# EasyEDA Pro project Choloepus.eprj, schematic Schematic1

## Sheets
1 P1: Create Date: 2024-03-04; Page Name: P1; Project Name: 柔性爪二代; Schematic Name: Schematic1; Update Date: 2024-11-28; Company: Tianjin University; Drawed: Xiang Chang; Page Size: A4; Reviewed: Xiang Chang; Version: V2.0
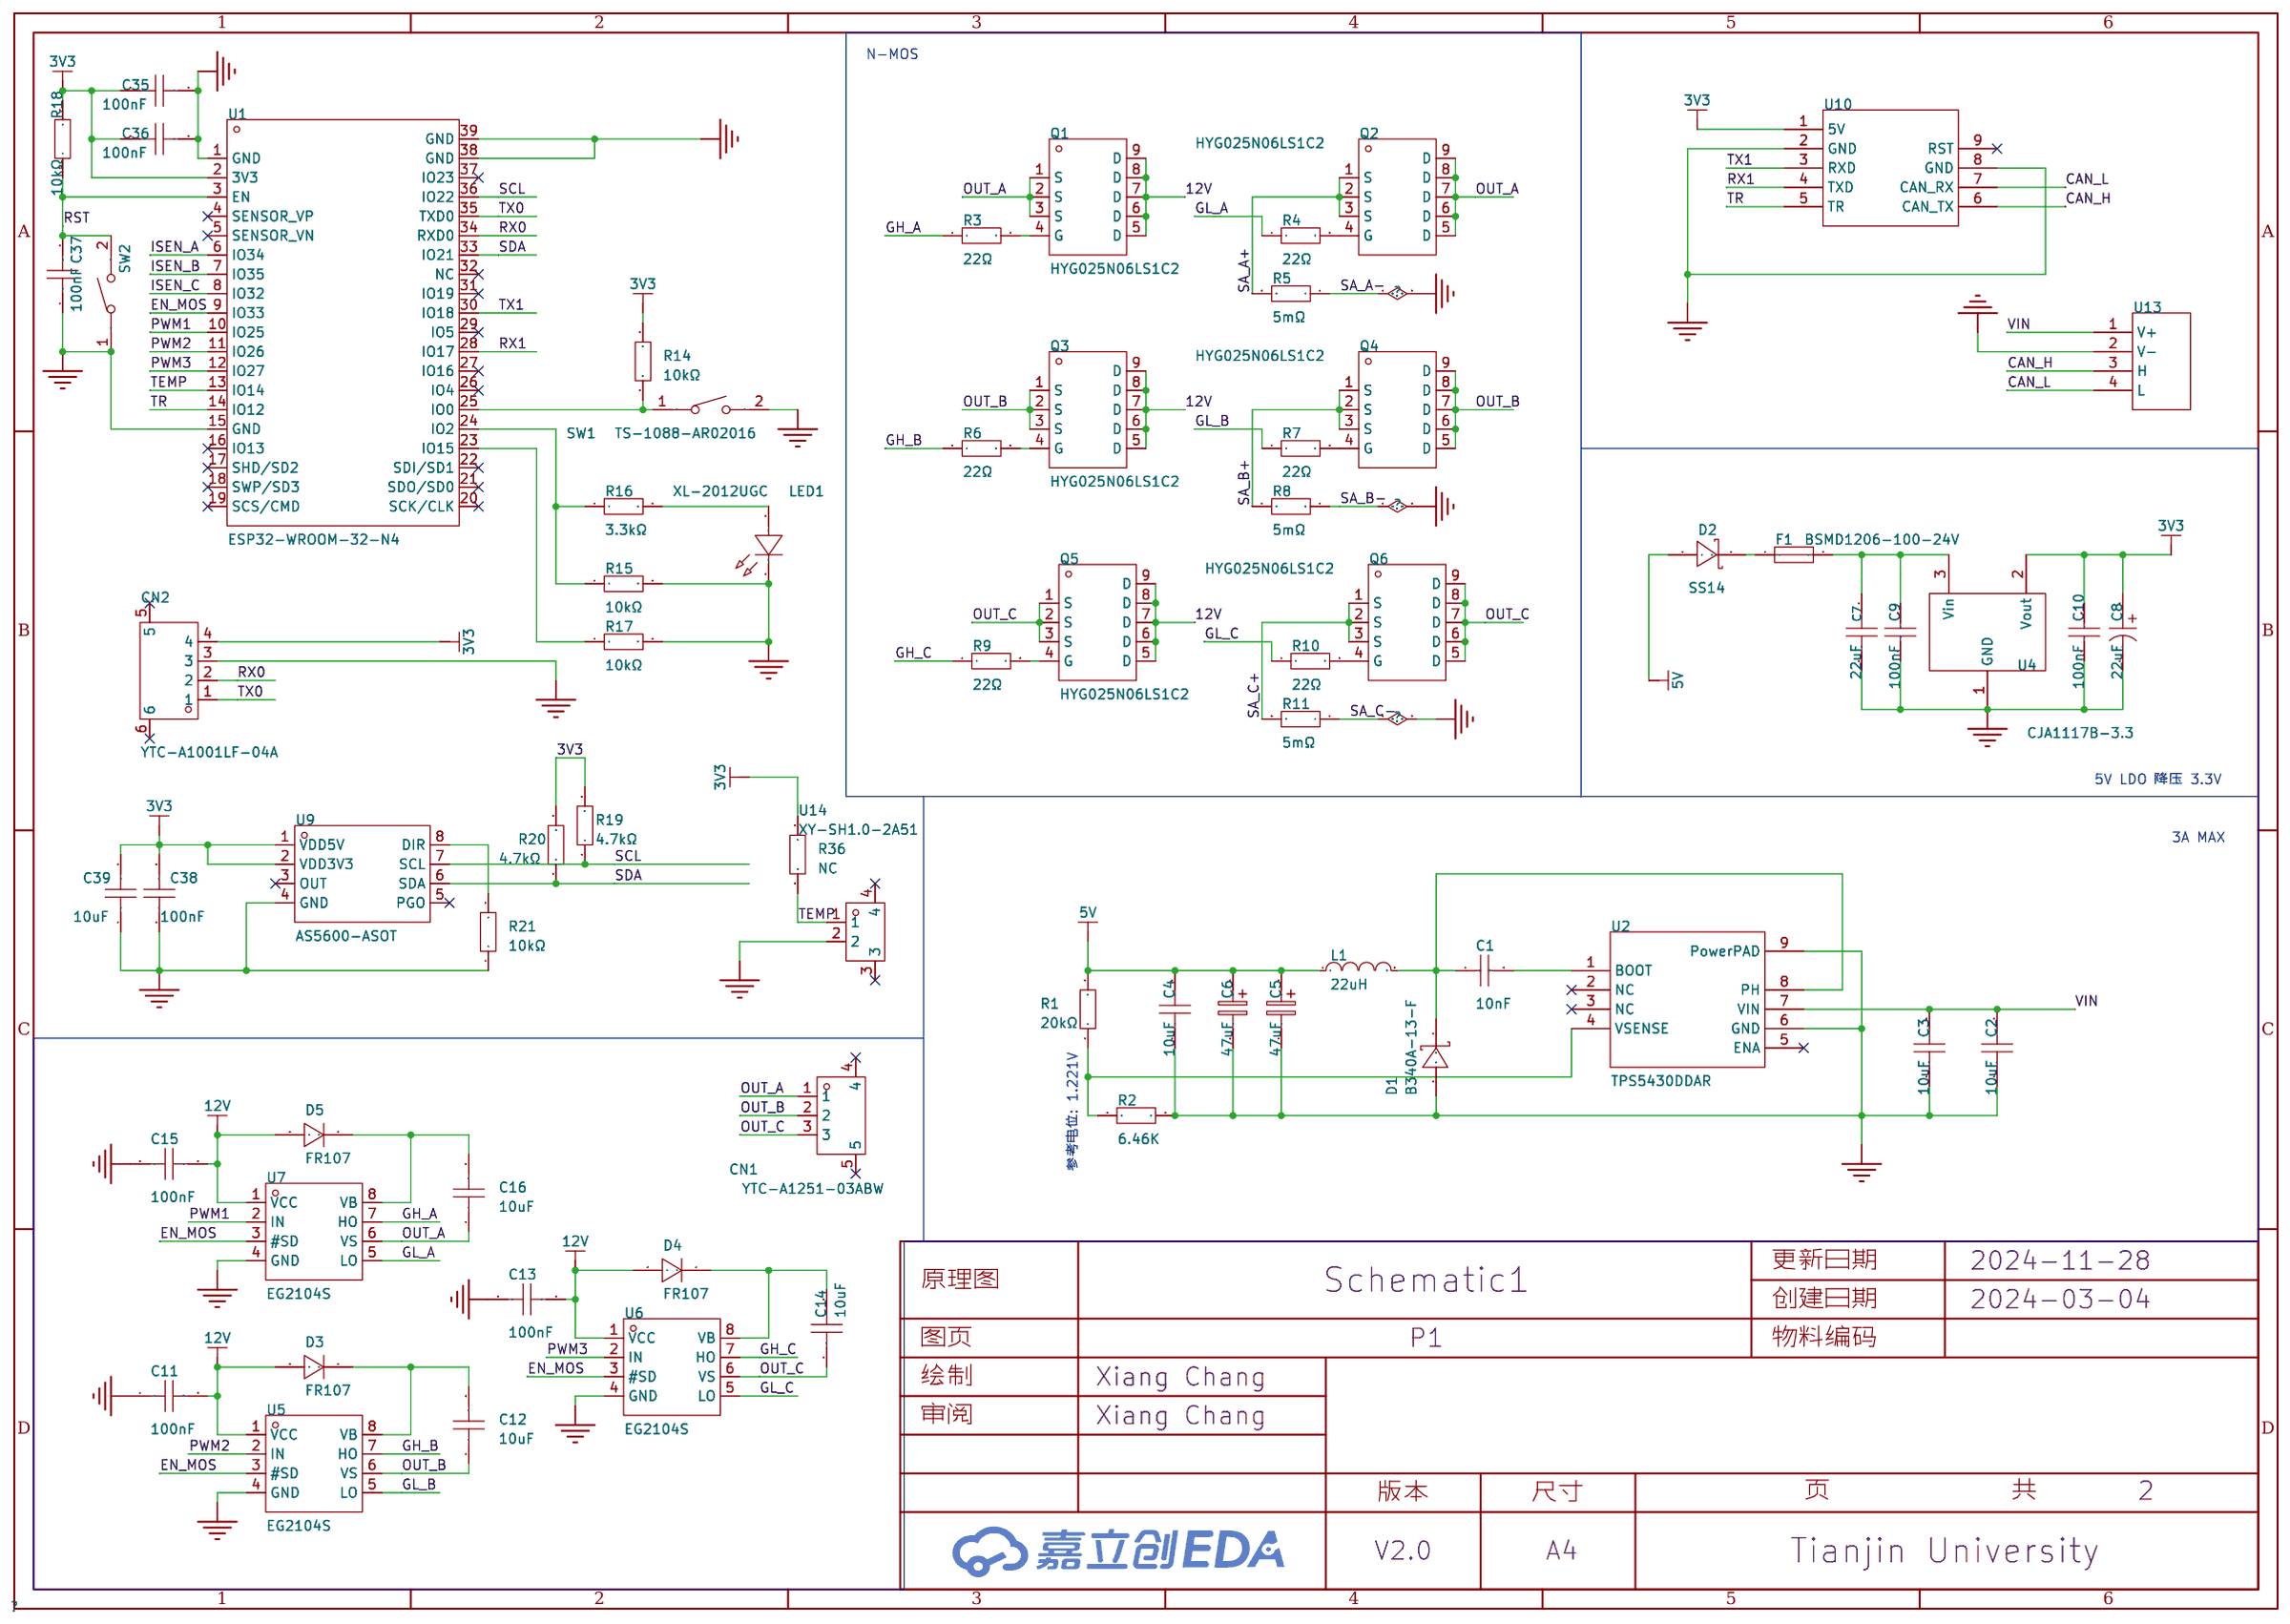
[diagram p0: P1]
2 P2: Create Date: 2024-03-07; Page Name: P2; Update Date: 2024-03-28
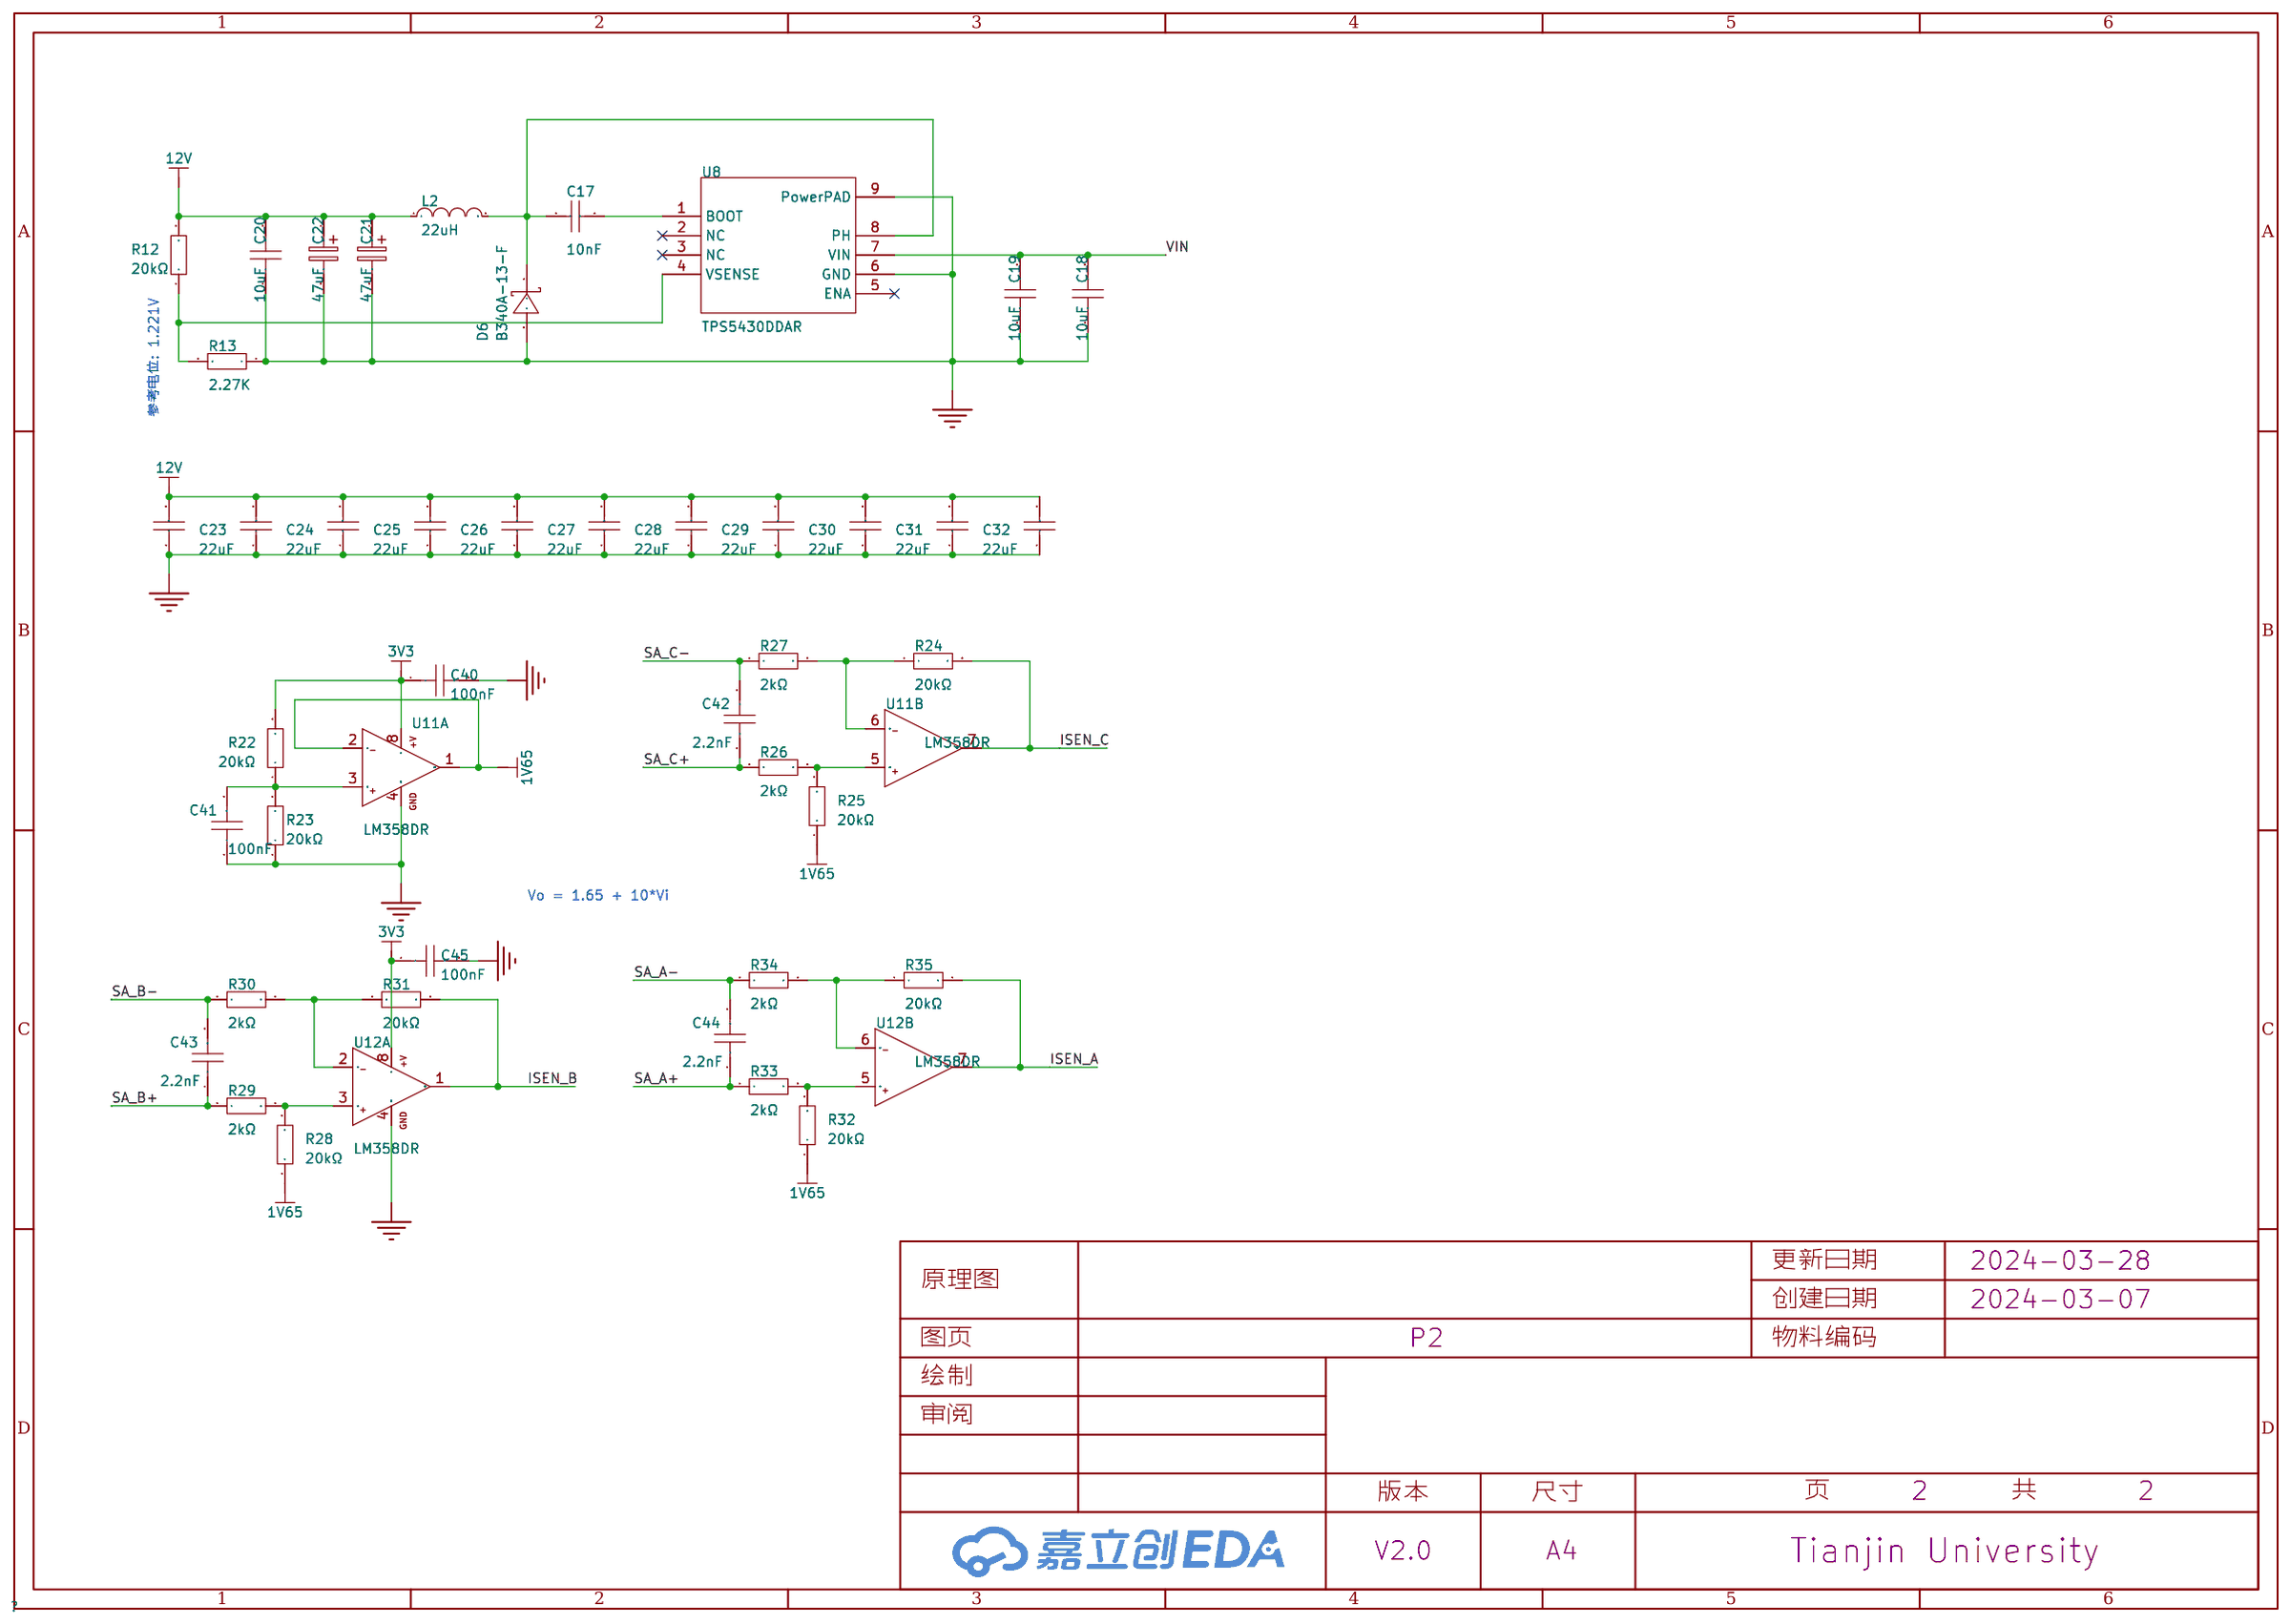
[diagram p1: P2]

## Parts
sheet P1
C1  10nF  [C0603]
C2  10uF  [C0805]
C3  10uF  [C0805]
C4  10uF  [C0805]
C5  47uF  [CAP-SMD_L3.5-W2.8-R-RD]
C6  47uF  [CAP-SMD_L3.5-W2.8-R-RD]
C7  22uF  [C0603]
C8  22uF  [CAP-SMD_L3.2-W1.6]
C9  100nF  [C0402]
C10  100nF  [C0402]
C11  100nF  [C0603]
C12  10uF  [C0805]
C13  100nF  [C0603]
C14  10uF  [C0805]
C15  100nF  [C0603]
C16  10uF  [C0805]
C35  100nF  [C0603]
C36  100nF  [C0603]
C37  100nF  [C0603]
C38  100nF  [C0603]
C39  10uF  [C0805]
CN1  YTC-A1251-03ABW  [CONN-SMD_3P-P1.25_YTC-A1251-03ABW]
CN2  YTC-A1001LF-04A  [CONN-TH_YTC-A1001LF-04A]
D1  B340A-13-F  [SMA_L4.4-W2.6-LS5.0-RD]
D2  SS14  [SMA_L4.2-W2.6-LS5.3-RD]
D3  FR107  [SOD-123_L2.8-W1.8-LS3.7-RD]
D4  FR107  [SOD-123_L2.8-W1.8-LS3.7-RD]
D5  FR107  [SOD-123_L2.8-W1.8-LS3.7-RD]
F1  BSMD1206-100-24V  [F1206]
L1  22uH  [IND-SMD_L7.0-W6.6_FXL0630]
LED1  XL-2012UGC  [LED0805-RD_GREEN]
Q1  HYG025N06LS1C2  [DFN-8_L5.9-W5.2-P1.27-LS6.2-BL]
Q2  HYG025N06LS1C2  [DFN-8_L5.9-W5.2-P1.27-LS6.2-BL]
Q3  HYG025N06LS1C2  [DFN-8_L5.9-W5.2-P1.27-LS6.2-BL]
Q4  HYG025N06LS1C2  [DFN-8_L5.9-W5.2-P1.27-LS6.2-BL]
Q5  HYG025N06LS1C2  [DFN-8_L5.9-W5.2-P1.27-LS6.2-BL]
Q6  HYG025N06LS1C2  [DFN-8_L5.9-W5.2-P1.27-LS6.2-BL]
R1  20kΩ  [R0603]
R2  6.46K  [R0603]
R3  22Ω  [R0603]
R4  22Ω  [R0603]
R5  5mΩ  [RES-SMD_L6.4-W3.2-1]
R6  22Ω  [R0603]
R7  22Ω  [R0603]
R8  5mΩ  [RES-SMD_L6.4-W3.2-1]
R9  22Ω  [R0603]
R10  22Ω  [R0603]
R11  5mΩ  [RES-SMD_L6.4-W3.2-1]
R14  10kΩ  [R0603]
R15  10kΩ  [R0603]
R16  3.3kΩ  [R0603]
R17  10kΩ  [R0603]
R18  10kΩ  [R0603]
R19  4.7kΩ  [R0603]
R20  4.7kΩ  [R0603]
R21  10kΩ  [R0603]
R36  NC  [R0603]
SW1  TS-1088-AR02016  [SW-SMD_L3.9-W3.0-P4.45]
SW2  TS-1088-AR02016  [SW-SMD_L3.9-W3.0-P4.45]
U1  ESP32-WROOM-32-N4  [WIFIM-SMD_ESP32-WROOM-32-N4]
U2  TPS5430DDAR  [ESOP-8_L4.9-W3.9-P1.27-LS6.0-TL-EP]
U4  CJA1117B-3.3  [SOT-89-3_L4.5-W2.5-P1.50-LS4.2-BR]
U5  EG2104S  [SOIC-8_L5.0-W4.0-P1.27-LS6.0-BL]
U6  EG2104S  [SOIC-8_L5.0-W4.0-P1.27-LS6.0-BL]
U7  EG2104S  [SOIC-8_L5.0-W4.0-P1.27-LS6.0-BL]
U9  AS5600-ASOT  [SOIC-8_L5.0-W4.0-P1.27-LS6.0-BL]
U10  -  [CAN-Niren-V2]
U13  -  [XT30PB(2+2)-M]
U14  XY-SH1.0-2A51  [CONN-SMD_2P-P1.00_XY-SH1.0-2A51]
sheet P2
C17  10nF  [C0603]
C18  10uF  [C0805]
C19  10uF  [C0805]
C20  10uF  [C0805]
C21  47uF  [CAP-SMD_L3.5-W2.8-R-RD]
C22  47uF  [CAP-SMD_L3.5-W2.8-R-RD]
C23  22uF  [C1206]
C24  22uF  [C1206]
C25  22uF  [C1206]
C26  22uF  [C1206]
C27  22uF  [C1206]
C28  22uF  [C1206]
C29  22uF  [C1206]
C30  22uF  [C1206]
C31  22uF  [C1206]
C32  22uF  [C1206]
C33  22uF  [C1206]
C40  100nF  [C0603]
C41  100nF  [C0603]
C42  2.2nF  [C0603]
C43  2.2nF  [C0603]
C44  2.2nF  [C0603]
C45  100nF  [C0603]
D6  B340A-13-F  [SMA_L4.4-W2.6-LS5.0-RD]
L2  22uH  [IND-SMD_L7.0-W6.6_FXL0630]
R12  20kΩ  [R0603]
R13  2.27K  [R0603]
R22  20kΩ  [R0603]
R23  20kΩ  [R0603]
R24  20kΩ  [R0603]
R25  20kΩ  [R0603]
R26  2kΩ  [R0603]
R27  2kΩ  [R0603]
R28  20kΩ  [R0603]
R29  2kΩ  [R0603]
R30  2kΩ  [R0603]
R31  20kΩ  [R0603]
R32  20kΩ  [R0603]
R33  2kΩ  [R0603]
R34  2kΩ  [R0603]
R35  20kΩ  [R0603]
U8  TPS5430DDAR  [ESOP-8_L4.9-W3.9-P1.27-LS6.0-TL-EP]
U11  LM358DR  [SOIC-8_L5.0-W4.0-P1.27-LS6.0-BL]  (sections 1,2)
U12  LM358DR  [SOIC-8_L5.0-W4.0-P1.27-LS6.0-BL]  (sections 1,2)

## Library data of the parts
C1 C17 = CC0603KRX7R9BB103: 容值:10nF;精度:±10%;额定电压:50V;材质(温度系数):X7R;; LCSC Part Name: 10nF ±10% 50V; Supplier Part: C100042; Manufacturer: YAGEO(国巨); Supplier Footprint: 0603; JLCPCB Part Class: Extended Part; Datasheet: https://atta.szlcsc.com/upload/public/pdf/source/20181008/C309510_22F155564471FAF6A489F7D68F34234E.pdf; Supplier: LCSC; Tolerance: ±10%; Voltage Rated: 50V; Temperature Coefficient: X7R
C2-C4 C12 C14 C16 C18-C20 C39 = GRM21BR61H106KE43L: 容值:10uF;精度:±10%;额定电压:50V;材质(温度系数):X5R;; LCSC Part Name: 10uF ±10% 50V; Supplier Part: C440198; Manufacturer: muRata(村田); Supplier Footprint: 0805; JLCPCB Part Class: Basic Part; Datasheet: https://atta.szlcsc.com/upload/public/pdf/source/20230811/95AAE0C9AF55EDC31B7A4D8B733F534E.pdf; Supplier: LCSC; Tolerance: ±10%; Voltage Rated: 50V; Temperature Coefficient: X5R
C5 C6 C21 C22 = CA45-B-16V-47uF-K: 容值:47uF;精度:±10%;额定电压:16V;等效串联电阻:3Ω@100kHz;; LCSC Part Name: 47uF ±10% 16V; Supplier Part: C136751; Manufacturer: CEC(振华新云); Supplier Footprint: CASE-B-3528; JLCPCB Part Class: Extended Part; Datasheet: https://atta.szlcsc.com/upload/public/pdf/source/20200817/C136751_89CB14FC7BB434027D9410E248BC6FA3.pdf; Supplier: LCSC; Tolerance: ±10%; Rated Voltage: 16V; Equivalent Series Resistance(ESR): 3Ω@100kHz; Operating Temperature: -55℃~+125℃
C7 = CL10A226MO7JZNC: 容值:22uF;精度:±20%;额定电压:16V;材质(温度系数):X5R;; LCSC Part Name: 22uF ±20% 16V; Supplier Part: C2762594; Manufacturer: SAMSUNG(三星); Supplier Footprint: 0603; JLCPCB Part Class: 扩展库; Datasheet: https://atta.szlcsc.com/upload/public/pdf/source/20220811/0832C3B1C642040B023B7A6186895861.pdf; Supplier: LCSC; Tolerance: ±20%; Voltage Rated: 16V; Temperature Coefficient: X5R
C8 = CA45-A-16V-22uF-K: 容值:22uF;精度:±10%;额定电压:16V;等效串联电阻:6Ω@100kHz;; LCSC Part Name: 22uF ±10% 16V; Supplier Part: C782264; Manufacturer: CEC(振华新云); Supplier Footprint: CASE-A-3216; JLCPCB Part Class: 扩展库; Datasheet: https://atta.szlcsc.com/upload/public/pdf/source/20200909/C782264_D6D9C4EF3B25E81633C26A9294FBB820.pdf; Supplier: LCSC; Tolerance: ±10%; Rated Voltage: 16V; Equivalent Series Resistance(ESR): 6Ω@100kHz; Operating Temperature: -55℃~+125℃
C9 C10 = CL05B104KB54PNC: 容值:100nF;精度:±10%;额定电压:50V;材质(温度系数):X7R;; LCSC Part Name: 100nF ±10% 50V; Supplier Part: C307331; Manufacturer: SAMSUNG(三星); Supplier Footprint: 0402; JLCPCB Part Class: Basic Part; Datasheet: https://atta.szlcsc.com/upload/public/pdf/source/20181009/C307331_222F7C870FD3EA5F46F538B483443886.pdf; Supplier: LCSC; Tolerance: ±10%; Voltage Rated: 50V; Temperature Coefficient: X7R
C11 C13 C15 C35-C37 C40 C41 C45 = 0603B104K500NT: 容值:100nF;精度:±10%;额定电压:50V;材质(温度系数):X7R;; LCSC Part Name: 100nF ±10% 50V; Supplier Part: C30926; Manufacturer: FH(风华); Supplier Footprint: 0603; JLCPCB Part Class: Extended Part; Datasheet: https://atta.szlcsc.com/upload/public/pdf/source/20200305/C486355_26A10D38EF8C2A5C37091D0039909270.pdf; Supplier: LCSC; Tolerance: ±10%; Voltage Rated: 50V; Temperature Coefficient: X7R
C38 = CC0603KRX7R9BB104: 容值:100nF;精度:±10%;额定电压:50V;材质(温度系数):X7R;; LCSC Part Name: 100nF ±10% 50V; Supplier Part: C14663; Manufacturer: YAGEO(国巨); Supplier Footprint: 0603; JLCPCB Part Class: 基础库; Datasheet: https://atta.szlcsc.com/upload/public/pdf/source/20180910/C282072_33301C7F631E79921B82A8DAC6BCC5B3.pdf; Supplier: LCSC; Tolerance: ±10%; Voltage Rated: 50V; Temperature Coefficient: X7R
CN1 = YTC-A1251-03ABW: 插针结构:1x3P;间距:1.25mm;安装方式:卧贴;总PIN数:3P;排数:1;每排PIN数:3;额定电流:1A;工作温度范围:-25℃~+85℃;; LCSC Part Name: 1.25mm 1x3P卧贴; Supplier Part: C7436576; Manufacturer: YIYUAN(怡远); Supplier Footprint: P=1.25mm; JLCPCB Part Class: 扩展库; Datasheet: https://atta.szlcsc.com/upload/public/pdf/source/20230703/1435987A1D1278BD8E0276EA6FE76C2F.pdf; Supplier: LCSC; Pins Structure: 1x3P; Pitch: 1.25mm; Mounting Style: 卧贴; Number of Pins: 3P; Number of Rows: 1; Number of PINs Per Row: 3; Current Rating (Max): 1A; Operating Temperature Range: -25℃~+85℃
CN2 = YTC-A1001LF-04A: 插针结构:1x4P;间距:1mm;安装方式:立贴;总PIN数:4P;排数:1;每排PIN数:4;额定电流:1A;工作温度范围:-25℃~+85℃;; LCSC Part Name: 1.0mm 1x4P立贴; Supplier Part: C7436582; Manufacturer: YIYUAN(怡远); Supplier Footprint: P=1mm; JLCPCB Part Class: Extended Part; Datasheet: https://atta.szlcsc.com/upload/public/pdf/source/20230703/56840124B43913079BB2E5DAB1E22112.pdf; Supplier: LCSC; Pins Structure: 1x4P; Pitch: 1mm; Mounting Style: 立贴; Number of Pins: 4P; Number of Rows: 1; Number of PINs Per Row: 4; Current Rating (Max): 1A; Operating Temperature Range: -25℃~+85℃; Contact Material: 磷青铜; Contact Plating: 锡
D1 D6 = B340A-13-F: 正向压降(Vf):500mV@3A;直流反向耐压(Vr):40V;平均整流电流(Io):3A;; LCSC Part Name: 电压:40V 电流:3A; Supplier Part: C85098; Manufacturer: DIODES(美台); Supplier Footprint: SMA(DO-214AC); JLCPCB Part Class: Extended Part; Datasheet: https://atta.szlcsc.com/upload/public/pdf/source/20171023/C134454_15087453575121052549.pdf; Supplier: LCSC; Forward Voltage (Vf@If): 500mV@3A; Reverse Voltage (Vr): 40V; Average Rectified Current (Io): 3A; Reverse Leakage Current (Ir): 500uA@40V
D2 = SS14_C2480: 二极管配置:独立式;正向压降(Vf):550mV@1A;直流反向耐压(Vr):40V;平均整流电流(Io):1A;; LCSC Part Name: 电压:40V 电流:1A; Supplier Part: C2480; Manufacturer: MDD; Supplier Footprint: SMA(DO-214AC); JLCPCB Part Class: 基础库; Datasheet: https://atta.szlcsc.com/upload/public/pdf/source/20230712/2DB6064CFBB99DE6DB116BEE8208BE66.pdf; Supplier: LCSC; Diode Configuration: 独立式; Forward Voltage (Vf@If): 550mV@1A; Reverse Voltage (Vr): 40V; Average Rectified Current (Io): 1A; Reverse Leakage Current (Ir): 500uA@40V
D3-D5 = FR107_C511885: 二极管配置:-;正向压降(Vf):1.3V@1A;直流反向耐压(Vr):1kV;平均整流电流(Io):1A;反向恢复时间(trr):500ns;; LCSC Part Name: 电压:1kV 电流:1A; Supplier Part: C511885; Manufacturer: BORN(伯恩半导体); Supplier Footprint: SOD-123; JLCPCB Part Class: Extended Part; Datasheet: https://atta.szlcsc.com/upload/public/pdf/source/20200413/C511885_F5BBF7A87475723E74BE0D118A106A7A.pdf; Supplier: LCSC; Forward Voltage (Vf@If): 1.3V@1A; Reverse Voltage (Vr): 1kV; Average Rectified Current (Io): 1A; Reverse Leakage Current: 5uA@1kV; Reverse Recovery Time (trr): 500ns; Operating Temperature: -55℃~+150℃@(Tj)
F1 = BSMD1206-100-24V: 最大电压:24V;最大电流:40A;保持电流:1A;跳闸电流:1.8A;; LCSC Part Name: 1206 1A 24V 佰宏高电压; Supplier Part: C910830; Manufacturer: BHFUSE(佰宏); Supplier Footprint: 1206; JLCPCB Part Class: 扩展库; Datasheet: https://atta.szlcsc.com/upload/public/pdf/source/20230512/E419278EC8529AAF514173EF221BCF4B.pdf; Supplier: LCSC; Operating Voltage (Max): 24V; Current Rating (Max): 40A; Hold Current: 1A; Trip Current: 1.8A; Power Dissipation: 1W; Resistance - Initial (Ri) (Min): 50mΩ; Resistance - Post Trip (R1) (Max): 270mΩ; Maximum Time to Trip: 300ms; Operating Temperature: -40℃~+85℃
L1 L2 = FXL0630-220-M: 电感值:22uH;精度:±20%;额定电流:2.5A;饱和电流(Isat):3A;类型:一体成型电感;; LCSC Part Name: 22uH ±20% 3A; Supplier Part: C177244; Manufacturer: cjiang(长江微电); Supplier Footprint: SMD,6.6x7mm; JLCPCB Part Class: Extended Part; Datasheet: https://atta.szlcsc.com/upload/public/pdf/source/20230516/3A080F5AF8C87BB81C3BA86E5F60E51A.pdf; Supplier: LCSC; Tolerance: ±20%; Rated Current: 2.5A; Saturation Current (Isat): 3A; DC Resistance (DCR): 200mΩ; Type: 一体成型电感
LED1 = XL-2012UGC: 发光颜色:翠绿色;功率:80mW;正向电流:25mA;主波长:516nm~525nm;透镜颜色:无色透明透镜;色温:-;发光角度:120°;载带方式:正贴;工作温度:-30℃~+85℃;; Supplier Part: C965815; Manufacturer: XINGLIGHT(成兴光); Supplier Footprint: 0805; JLCPCB Part Class: 扩展库; Datasheet: https://atta.szlcsc.com/upload/public/pdf/source/20221102/ACA6CBC413A1A8AF38BEBA54306464BE.pdf; Supplier: LCSC; Emitted Color: 翠绿色; Power Dissipation: 80mW; Forward Current: 25mA; Dominant Wavelength: 516nm~525nm; Peak Wavelength: 534nm; Lens Color: 无色透明透镜; Viewing Angle: 120°; Mounting Sytle: 正贴; Operating Temperature: -30℃~+85℃
Q1-Q6 = HYG025N06LS1C2: 类型:N沟道;漏源电压(Vdss):60V;连续漏极电流(Id):170A;功率(Pd):130W;导通电阻(RDS(on)@Vgs,Id):2.1mΩ@10V,20A;阈值电压(Vgs(th)@Id):2.1V@250uA;; LCSC Part Name: N沟道 耐压:60V 电流:170A; Supplier Part: C2827231; Manufacturer: HUAYI(华羿微); Supplier Footprint: DFN-8(5.2x5.9); JLCPCB Part Class: Extended Part; Datasheet: https://atta.szlcsc.com/upload/public/pdf/source/20210419/C2827231_13841C0339ED96AF58AC5A6C3EF7CB2D.pdf; Supplier: LCSC; Type: N沟道; Drain Source Voltage (Vdss): 60V; Continuous Drain Current (Id): 170A; Power Dissipation (Pd): 130W; Drain Source On Resistance (RDS(on)@Vgs,Id): 2.1mΩ@10V,20A; Gate Threshold Voltage (Vgs(th)@Id): 2.1V@250uA; Total Gate Charge (Qg@Vgs): 28.2nC@10V; Input Capacitance (Ciss@Vds): 3.915nF@25V; Reverse Transfer Capacitance (Crss@Vds): 10.2pF@25V
R1 R12 R22-R25 R28 R31 R32 R35 = 0603WAF2002T5E: 电阻类型:厚膜电阻;阻值:20kΩ;精度:±1%;功率:100mW;最大工作电压:75V;温度系数:±100ppm/℃;; LCSC Part Name: 20kΩ ±1% 100mW 厚膜电阻; Supplier Part: C4184; Manufacturer: UNI-ROYAL(厚声); Supplier Footprint: 0603; JLCPCB Part Class: Basic Part; Datasheet: https://atta.szlcsc.com/upload/public/pdf/source/20200306/C422600_1E6D84923E4A46A82E41ADD87F860B5C.pdf; Supplier: LCSC; Type: 厚膜电阻; Tolerance: ±1%; Power(Watts): 100mW; Overload Voltage (Max): 75V; Temperature Coefficient: ±100ppm/℃; Operating Temperature Range: -55℃~+155℃
R2 R13 = Res_0603: Supplier Footprint: 0603; Standardization Check: false
R3 R4 R6 R7 R9 R10 = 0603WAF220JT5E: 电阻类型:厚膜电阻;阻值:22Ω;精度:±1%;功率:100mW;最大工作电压:75V;温度系数:±100ppm/℃;; LCSC Part Name: 22Ω ±1% 100mW 厚膜电阻; Supplier Part: C23345; Manufacturer: UNI-ROYAL(厚声); Supplier Footprint: 0603; JLCPCB Part Class: Basic Part; Datasheet: https://atta.szlcsc.com/upload/public/pdf/source/20200306/C422600_1E6D84923E4A46A82E41ADD87F860B5C.pdf; Supplier: LCSC; Type: 厚膜电阻; Tolerance: ±1%; Power(Watts): 100mW; Overload Voltage (Max): 75V; Temperature Coefficient: ±100ppm/℃; Operating Temperature Range: -55℃~+155℃
R5 R8 R11 = RLP25FEGMR005: 电阻类型:采样电阻;阻值:5mΩ;精度:±1%;额定压降:-;功率:3W;温度系数:±50ppm/℃;安装方式:贴片;; LCSC Part Name: 5mΩ ±1% 3W; Supplier Part: C393074; Manufacturer: 大毅科技; Supplier Footprint: 2512; JLCPCB Part Class: Extended Part; Datasheet: https://atta.szlcsc.com/upload/public/pdf/source/20191016/C437152_56BA2D1CA54CB05F65C989188AF9FC43.pdf; Supplier: LCSC; Type: 采样电阻; Tolerance: ±1%; Power(Watts): 3W; Temperature Coefficient: ±50ppm/℃; Mounting Sytle: 贴片
R14 R15 R17 R18 R21 = 0603WAF1002T5E: 电阻类型:厚膜电阻;阻值:10kΩ;精度:±1%;功率:100mW;最大工作电压:75V;温度系数:±100ppm/℃;; LCSC Part Name: 厚膜电阻 10kΩ ±1% 100mW; Supplier Part: C25804; Manufacturer: UNI-ROYAL(厚声); Supplier Footprint: 0603; JLCPCB Part Class: Basic Part; Datasheet: https://atta.szlcsc.com/upload/public/pdf/source/20200306/C422600_1E6D84923E4A46A82E41ADD87F860B5C.pdf; Supplier: LCSC; Type: 厚膜电阻; Tolerance: ±1%; Power(Watts): 100mW; Overload Voltage (Max): 75V; Temperature Coefficient: ±100ppm/℃; Operating Temperature Range: -55℃~+155℃
R16 = 0603WAF3301T5E: 电阻类型:厚膜电阻;阻值:3.3kΩ;精度:±1%;功率:100mW;最大工作电压:75V;温度系数:±100ppm/℃;; LCSC Part Name: 3.3kΩ ±1% 100mW 厚膜电阻; Supplier Part: C22978; Manufacturer: UNI-ROYAL(厚声); Supplier Footprint: 0603; JLCPCB Part Class: Basic Part; Datasheet: https://atta.szlcsc.com/upload/public/pdf/source/20200306/C422600_1E6D84923E4A46A82E41ADD87F860B5C.pdf; Supplier: LCSC; Type: 厚膜电阻; Tolerance: ±1%; Power(Watts): 100mW; Overload Voltage (Max): 75V; Temperature Coefficient: ±100ppm/℃; Operating Temperature Range: -55℃~+155℃
R19 R20 = 0603WAF4701T5E: 阻值:4.7kΩ;精度:±1%;功率:100mW;温度系数:±100ppm/℃;电阻类型:厚膜电阻;; LCSC Part Name: 4.7kΩ ±1% 100mW 厚膜电阻; Supplier Part: C23162; Manufacturer: UNI-ROYAL(厚声); Supplier Footprint: 0603; JLCPCB Part Class: Basic Part; Datasheet: https://atta.szlcsc.com/upload/public/pdf/source/20200306/C422600_1E6D84923E4A46A82E41ADD87F860B5C.pdf; Supplier: LCSC; Tolerance: ±1%; Power(Watts): 100mW; Overload Voltage (Max): 75V; Temperature Coefficient: ±100ppm/℃; Type: 厚膜电阻; Operating Temperature Range: -55℃~+155℃
R36 = Res_0603: Supplier Footprint: 0603
SW1 SW2 = TS-1088-AR02016: 电路结构:单刀单掷;按钮形状:圆形按钮;作用力:160gf;安装方式:立贴;开关长度:4mm;开关宽度:3mm;开关高度:2mm;带支架:不带;触点电流:50mA;额定电压(DC):12V;绝缘电阻:100MΩ;机械寿命:10万次;; LCSC Part Name: 4*3*2mm 立贴 轻触开关; Supplier Part: C720477; Manufacturer: XUNPU(讯普); Supplier Footprint: SMD; JLCPCB Part Class: 扩展库; Datasheet: https://atta.szlcsc.com/upload/public/pdf/source/20200810/C720475_60D09DD6C54279ADDB2DC25100F1CC11.pdf; Supplier: LCSC; Circuit: 单刀单掷; Actuator Style: 圆形按钮; Operating Force: 160gf; Mounting Style: 立贴; Switch Length: 4mm; Switch Width: 3mm; Switch Height: 2mm; Strike Gundam: 不带; Contact Current: 50mA; Voltage Rating (DC): 12V; Insulation Resistance: 100MΩ; Actuator/Cap Color: 黑色; Pin Style: SMD接片; Mechanical Life: 10万次; Operating Temperature: -30℃~+80℃
U1 = ESP32-WROOM-32-N4: WiFi+蓝牙4.2+双核CPU,ESP32; LCSC Part Name: WiFi+蓝牙4.2+双核CPU模块; Supplier Part: C82899; Manufacturer: ESPRESSIF(乐鑫); Supplier Footprint: SMD,18x25.5mm; JLCPCB Part Class: Extended Part; Datasheet: https://atta.szlcsc.com/upload/public/pdf/source/20210719/C82899_2D52724B6FAFABC419BCF308C5944296.pdf; Supplier: LCSC
U2 U8 = TPS5430DDAR: 功能类型:降压型;输出类型:可调;输入电压:5.5V~36V;输出电压:1.221V~32.04V;输出电流(最大值):3A;; LCSC Part Name: 降压 3A 36V; Supplier Part: C9864; Manufacturer: TI(德州仪器); Supplier Footprint: SOIC-8-EP; JLCPCB Part Class: 基础库; Datasheet: https://www.ti.com/cn/lit/gpn/tps5430; Supplier: LCSC; Function: 降压型; Output Type: 可调; Input Voltage: 5.5V~36V; Output Voltage: 1.221V~32.04V; Output Current (Max): 3A; Switching Frequency: 500kHz; Operating Temperature: -40℃~+125℃@(TJ); Synchronous Rectification: 否; Number of Outputs: 1; Topology: 降压式; Switch tube (built-in/external): 内置
U4 = CJA1117B-3.3: 输出类型:固定;最大输入电压:15V;输出电压:3.3V;输出电流:1A;电源纹波抑制比(PSRR):75dB@(120Hz);输出极性:正;; LCSC Part Name: 输入15V 输出3.3V 1A; Supplier Part: C24253; Manufacturer: CJ(江苏长电/长晶); Supplier Footprint: SOT-89-3; JLCPCB Part Class: Extended Part; Datasheet: https://atta.szlcsc.com/upload/public/pdf/source/20170719/C107222_1500457721357828222.pdf; Supplier: LCSC; Output Type: 固定; Maximum Input Voltage: 15V; Output Voltage: 3.3V; Output Current: 1A; Power Supply Rejection Ratio (PSRR): 75dB@(120Hz); Dropout Voltage: 1.3V@(1A); Output Polarity: 正; Number of Outputs: 1
U5-U7 = EG2104S: Supplier Part: C480652; Manufacturer: EG(屹晶微); Supplier Footprint: SOIC-8; JLCPCB Part Class: Extended Part; Datasheet: https://atta.szlcsc.com/upload/public/pdf/source/20200107/C480652_F6747CE49A4141A3459309A1DCCBEFEE.pdf; Supplier: LCSC
U9 = AS5600-ASOT: Supplier Part: C499458; Manufacturer: ams(艾迈斯半导体); Supplier Footprint: SOIC-8; JLCPCB Part Class: Extended Part; Datasheet: https://atta.szlcsc.com/upload/public/pdf/source/20200324/C499458_E1461AFB0CE1042DE5756821C534625C.pdf; Supplier: LCSC
U10 = CAN-Niren-V2: CAN-Niren-V2 / 原理图; Standardization Check: false
U13 = XT30PB(2+2)-M: Standardization Check: false
U14 = XY-SH1.0-2A51: 插针结构:1x2P;间距:1mm;安装方式:立贴;总PIN数:2P;排数:1;每排PIN数:2;; LCSC Part Name: 间距:1.0 1x2P 立贴; Supplier Part: C19272005; Manufacturer: XYECONN(辛译); Supplier Footprint: SMD,P=1mm; Datasheet: https://atta.szlcsc.com/upload/public/pdf/source/20231128/C6B60C64F4338683BC8BC065CCF39725.pdf; Supplier: LCSC; Pins Structure: 1x2P; Pitch: 1mm; Mounting Style: 立贴; Number of Pins: 2P; Number of Rows: 1; Number of PINs Per Row: 2
C23-C33 = CL31A226KAHNNNE: 容值:22uF;精度:±10%;额定电压:25V;材质(温度系数):X5R;; LCSC Part Name: 22uF ±10% 25V; Supplier Part: C12891; Manufacturer: SAMSUNG(三星); Supplier Footprint: 1206; JLCPCB Part Class: Basic Part; Datasheet: https://atta.szlcsc.com/upload/public/pdf/source/20160218/1457707763339.pdf; Supplier: LCSC; Tolerance: ±10%; Voltage Rated: 25V; Temperature Coefficient: X5R
C42-C44 = 0603B222K500NT: 容值:2.2nF;精度:±10%;额定电压:50V;材质(温度系数):X7R;; LCSC Part Name: 2.2nF ±10% 50V; Supplier Part: C1604; Manufacturer: FH(风华); Supplier Footprint: 0603; JLCPCB Part Class: Basic Part; Datasheet: https://atta.szlcsc.com/upload/public/pdf/source/20200305/C486355_26A10D38EF8C2A5C37091D0039909270.pdf; Supplier: LCSC; Tolerance: ±10%; Voltage Rated: 50V; Temperature Coefficient: X7R
R26 R27 R29 R30 R33 R34 = 0603WAF2001T5E: 电阻类型:厚膜电阻;阻值:2kΩ;精度:±1%;功率:100mW;最大工作电压:75V;温度系数:±100ppm/℃;; LCSC Part Name: 2kΩ ±1% 100mW 厚膜电阻; Supplier Part: C22975; Manufacturer: UNI-ROYAL(厚声); Supplier Footprint: 0603; JLCPCB Part Class: Basic Part; Datasheet: https://atta.szlcsc.com/upload/public/pdf/source/20200306/C422600_1E6D84923E4A46A82E41ADD87F860B5C.pdf; Supplier: LCSC; Type: 厚膜电阻; Tolerance: ±1%; Power(Watts): 100mW; Overload Voltage (Max): 75V; Temperature Coefficient: ±100ppm/℃; Operating Temperature Range: -55℃~+155℃
U11 U12 = LM358DR: 放大器数:双路;增益带宽积(GBP):700kHz;输入偏置电流(Ib):20nA;压摆率(SR):0.3V/us;带宽(-3db):-;; LCSC Part Name: 行业标准双路运算放大器; Supplier Part: C5423; Manufacturer: TI(德州仪器); Supplier Footprint: SOIC-8; JLCPCB Part Class: 扩展库; Datasheet: https://www.ti.com/cn/lit/gpn/lm358; Supplier: LCSC; Number of Circuits: 双路; Gain Bandwidth Product(GBP): 700kHz; Current - Input Bias(Ib): 20nA; Slew Rate(SR): 0.3V/us; Output Current: 40mA; Supply Current: 1mA; Operating Temperature: 0℃~+70℃

## Nets
1V65: R25.1 R28.1 R32.1 U11.1(OUT1) U11.2(-IN1)
3V3: C8.1 C10.2 C35.1 C36.1 C38.2 C39.2 C40.1 C45.1 CN2.4 R14.2 R18.2 R19.2 R20.2 R22.2 R36.2 U1.2(3V3) U4.2(Vout) U9.1(VDD5V) U9.2(VDD3V3) U10.1(5V) U11.8(+V) U12.8(+V)
5V: C4.2 C5.1 C6.1 D2.2(A) L1.1 R1.2
12V: C11.2 C13.2 C15.2 C20.2 C21.1 C22.1 C23.2 C24.2 C25.2 C26.2 C27.2 C28.2 C29.2 C30.2 C31.2 C32.2 C33.2 D3.2(A) D4.2(A) D5.2(A) L2.1 Q1.5(D) Q1.6(D) Q1.7(D) Q1.8(D) Q1.9(D) Q3.5(D) Q3.6(D) Q3.7(D) Q3.8(D) Q3.9(D) Q5.5(D) Q5.6(D) Q5.7(D) Q5.8(D) Q5.9(D) R12.2 U5.1(VCC) U6.1(VCC) U7.1(VCC)
GND: C2.1 C3.1 C4.1 C5.2 C6.2 C7.2 C8.2 C9.1 C10.1 C11.1 C13.1 C15.1 C18.1 C19.1 C20.1 C21.2 C22.2 C23.1 C24.1 C25.1 C26.1 C27.1 C28.1 C29.1 C30.1 C31.1 C32.1 C33.1 C35.2 C36.2 C37.1 C38.1 C39.1 C40.2 C41.1 C42.2 C43.2 C44.2 C45.2 CN2.3 D1.2(A) D6.2(A) LED1.1(K) R2.1 R5.1 R8.1 R11.1 R13.1 R15.2 R17.2 R21.1 R23.1 R27.1 R30.1 R34.1 SW1.2 SW2.1 U1.1(GND) U1.15(GND) U1.38(GND) U1.39(GND) U2.6(GND) U2.9(PowerPAD) U4.1(GND) U5.4(GND) U6.4(GND) U7.4(GND) U8.6(GND) U8.9(PowerPAD) U9.4(GND) U10.2(GND) U10.8(GND) U11.4(GND) U12.4(GND) U13.2(V-) U14.2
VIN: C2.2 C3.2 C18.2 C19.2 U2.7(VIN) U8.7(VIN) U13.1(V+)
CAN_H: U10.6(CAN_TX) U13.3(H)
CAN_L: U10.7(CAN_RX) U13.4(L)
EN_MOS: U1.9(IO33) U5.3(#SD) U6.3(#SD) U7.3(#SD)
GH_A: R3.1 U7.7(HO)
GH_B: R6.1 U5.7(HO)
GH_C: R9.1 U6.7(HO)
GL_A: R4.1 U7.5(LO)
GL_B: R7.1 U5.5(LO)
GL_C: R10.1 U6.5(LO)
ISEN_A: R35.2 U1.6(IO34) U12.7(OUT2)
ISEN_B: R31.2 U1.7(IO35) U12.1(OUT1)
ISEN_C: R24.2 U1.8(IO32) U11.7(OUT2)
OUT_A: C16.1 CN1.1 Q1.1(S) Q1.2(S) Q1.3(S) Q2.5(D) Q2.6(D) Q2.7(D) Q2.8(D) Q2.9(D) U7.6(VS)
OUT_B: C12.1 CN1.2 Q3.1(S) Q3.2(S) Q3.3(S) Q4.5(D) Q4.6(D) Q4.7(D) Q4.8(D) Q4.9(D) U5.6(VS)
OUT_C: C14.1 CN1.3 Q5.1(S) Q5.2(S) Q5.3(S) Q6.5(D) Q6.6(D) Q6.7(D) Q6.8(D) Q6.9(D) U6.6(VS)
PWM1: U1.10(IO25) U7.2(IN)
PWM2: U1.11(IO26) U5.2(IN)
PWM3: U1.12(IO27) U6.2(IN)
RST: C37.2 R18.1 SW2.2 U1.3(EN)
RX0: CN2.2 U1.34(RXD0)
RX1: U1.28(IO17) U10.4(TXD)
SA_A+: C44.1 Q2.1(S) Q2.2(S) Q2.3(S) R5.2 R33.1
SA_B+: C43.1 Q4.1(S) Q4.2(S) Q4.3(S) R8.2 R29.1
SA_C+: C42.1 Q6.1(S) Q6.2(S) Q6.3(S) R11.2 R26.1
SCL: R19.1 U1.36(IO22) U9.7(SCL)
SDA: R20.1 U1.33(IO21) U9.6(SDA)
TEMP: R36.1 U1.13(IO14) U14.1
TR: U1.14(IO12) U10.5(TR)
TX0: CN2.1 U1.35(TXD0)
TX1: U1.30(IO18) U10.3(RXD)
$1N650: C1.2 U2.1(BOOT)
$1N722: C1.1 D1.1(K) L1.2 U2.8(PH)
$1N1371: R1.1 R2.2 U2.4(VSENSE)
$1N1971: C7.1 C9.2 F1.2 U4.3(Vin)
$1N1973: D2.1(K) F1.1
$1N2491: C12.2 D3.1(K) U5.8(VB)
$1N2701: C14.2 D4.1(K) U6.8(VB)
$1N2890: C16.2 D5.1(K) U7.8(VB)
$1N3593: Q1.4(G) R3.2
$1N3664: Q2.4(G) R4.2
$1N4096: Q3.4(G) R6.2
$1N4107: Q4.4(G) R7.2
$1N4356: Q5.4(G) R9.2
$1N4367: Q6.4(G) R10.2
$1N5511: R14.1 SW1.1 U1.25(IO0)
$1N5798: R15.1 R16.1 U1.24(IO2)
$1N5805: LED1.2(A) R16.2
$1N5929: R17.1 U1.23(IO15)
$1N7274: R21.2 U9.8(DIR)
$2N446: C17.2 U8.1(BOOT)
$2N447: C17.1 D6.1(K) L2.2 U8.8(PH)
$2N452: R12.1 R13.2 U8.4(VSENSE)
$2N1488: C41.2 R22.1 R23.2 U11.3(+IN1)
$2N1627: R25.2 R26.2 U11.5(+IN2)
$2N1790: R24.1 R27.2 U11.6(-IN2)
$2N2142: R28.2 R29.2 U12.3(+IN1)
$2N2146: R30.2 R31.1 U12.2(-IN1)
$2N2347: R32.2 R33.2 U12.5(+IN2)
$2N2351: R34.2 R35.1 U12.6(-IN2)

Not connected (* = marked no-connect by the designer): CN1 4* 5*; CN2 5* 6*; U1 4(SENSOR_VP)* 5(SENSOR_VN)* 16(IO13)* 17(SHD/SD2)* 18(SWP/SD3)* 19(SCS/CMD)* 20(SCK/CLK)* 21(SDO/SD0)* 22(SDI/SD1)* 26(IO4)* 27(IO16)* 29(IO5)* 31(IO19)* 32(NC)* 37(IO23)*; U2 2(NC)* 3(NC)* 5(ENA)*; U8 2(NC)* 3(NC)* 5(ENA)*; U9 3(OUT)* 5(PGO)*; U10 9(RST)*; U14 3* 4*

## Notes on the sheets
sheet 1
- N-MOS
- 5V LDO 降压 3.3V
- 3A MAX
- 参考电位: 1.221V
sheet 2
- 参考电位: 1.221V
- Vo = 1.65 + 10*Vi
